# EAGLE design thermocouple-sensor (EAGLE 5.01)
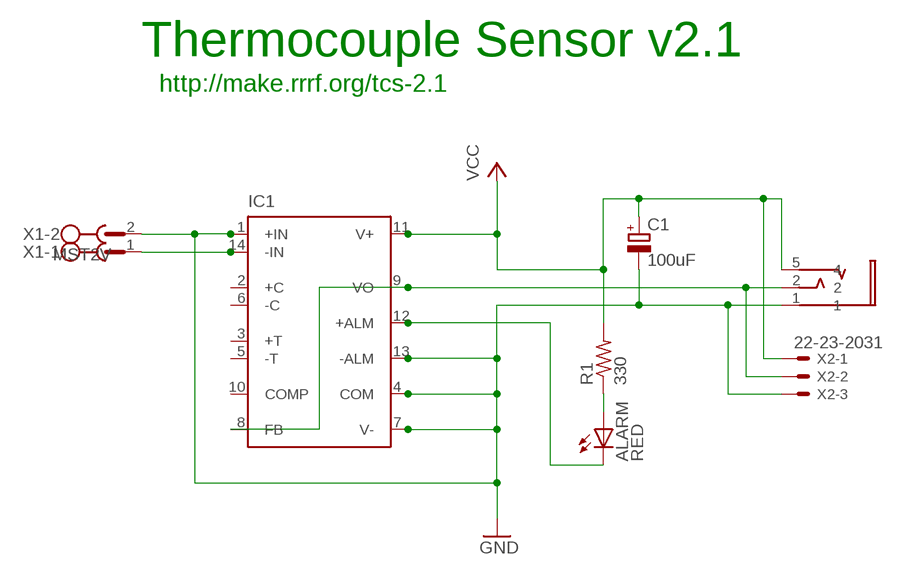
[diagram p0: schematic, sheet 1]

## Parts
ALARM  RED  LED5MM  [LED5MM]
C1  100uF  CPOL-EUE5-10.5  [E5-10,5]
IC1  AD595  [DIL14]
R1  330  R-US_0207/7  [0207/7]
U$1  3.5MM_JACKKYCON  [STX-3081]
X1  MST2V  [MSTBV2]
X2  22-23-2031  [22-23-2031]

## Nets
GND: C1.- IC1.1(+IN) IC1.4(COM) IC1.7(V-) IC1.13(-ALM) U$1.1 X1.2 X2.3
N$1: ALARM.A R1.1
N$2: ALARM.K(C) IC1.12(+ALM)
N$3: IC1.14(-IN) X1.1
N$5: IC1.8(FB) IC1.9(VO) U$1.2 X2.2
VCC: C1.+ IC1.11(V+) R1.2 U$1.5 X2.1
Unconnected: IC1.2(+C) IC1.3(+T) IC1.5(-T) IC1.6(-C) IC1.10(COMP)

## Notes on the sheet
- Thermocouple Sensor v2.1
- http://make.rrrf.org/tcs-2.1

## Library data of the parts
ALARM = led:LED: LED OSRAM: - CHIPLED LG R971, LG N971, LY N971, LG Q971, LY Q971, LO R971, LY R971 LH N974, LH R974 LS Q976, LO Q976, LY Q976 LO Q996 - Hyper CHIPLED LW Q18S LB Q993, LB Q99A, LB R99A - SideLED LS A670, LO A670, LY A670, LG A670, LP A670 LB A673, LV A673, LT A673, LW A673 LH A674 LY A675 LS A676, LA A676, LO A676, LY A676, LW A676 LS A679, LY A679, LG A679 - Hyper Micro SIDELED® LS Y876, LA Y876, LO Y876, LY Y876 LT Y87S - SmartLED LW L88C, LW L88S LB L89C, LB L89S, LG L890 LS L89K, LO L89K, LY L89K LS L896, LA L896, LO L896, LY L896 - TOPLED LS T670, LO T670, LY T670, LG T670, LP T670 LSG T670, LSP T670, LSY T670, LOP T670, LYG T670 LG T671, LOG T671, LSG T671 LB T673, LV T673, LT T673, LW T673 LH T674 LS T676, LA T676, LO T676, LY T676, LB T676, LH T676, LSB T676, LW T676 LB T67C, LV T67C, LT T67C, LS T67K, LO T67K, LY T67K, LW E67C LS E67B, LA E67B, LO E67B, LY E67B, LB E67C, LV E67C, LT E67C LW T67C LS T679, LY T679, LG T679 LS T770, LO T770, LY T770, LG T770, LP T770 LB T773, LV T773, LT T773, LW T773 LH T774 LS E675, LA E675, LY E675, LS T675 LS T776, LA T776, LO T776, LY T776, LB T776 LHGB T686 LT T68C, LB T68C - Hyper Mini TOPLED® LB M676 - Mini TOPLED Santana® LG M470 LS M47K, LO M47K, LY M47K Source: http://www.osram.convergy.de - LUMILED® LXK2-PW12-R00, LXK2-PW12-S00, LXK2-PW14-U00, LXK2-PW14-V00 LXK2-PM12-R00, LXK2-PM12-S00, LXK2-PM14-U00 LXK2-PE12-Q00, LXK2-PE12-R00, LXK2-PE12-S00, LXK2-PE14-T00, LXK2-PE14-U00 LXK2-PB12-K00, LXK2-PB12-L00, LXK2-PB12-M00, LXK2-PB14-N00, LXK2-PB14-P00, LXK2-PB14-Q00 LXK2-PR12-L00, LXK2-PR12-M00, LXK2-PR14-Q00, LXK2-PR14-R00 LXK2-PD12-Q00, LXK2-PD12-R00, LXK2-PD12-S00 LXK2-PH12-R00, LXK2-PH12-S00 LXK2-PL12-P00, LXK2-PL12-Q00, LXK2-PL12-R00 Source: www.luxeon.com
C1 = rcl:CPOL-EU: POLARIZED CAPACITOR, European symbol
IC1 = analog-devices:AD595: ANALOG DEVICES
R1 = rcl:R-US_: RESISTOR, American symbol
U$1 = reprap:3.5MM_JACK
X1 = con-phoenix-508:MST2V: PHOENIX
X2 = con-molex:22-23-2031: .100" (2.54mm) Center Header - 3 Pin

## Board
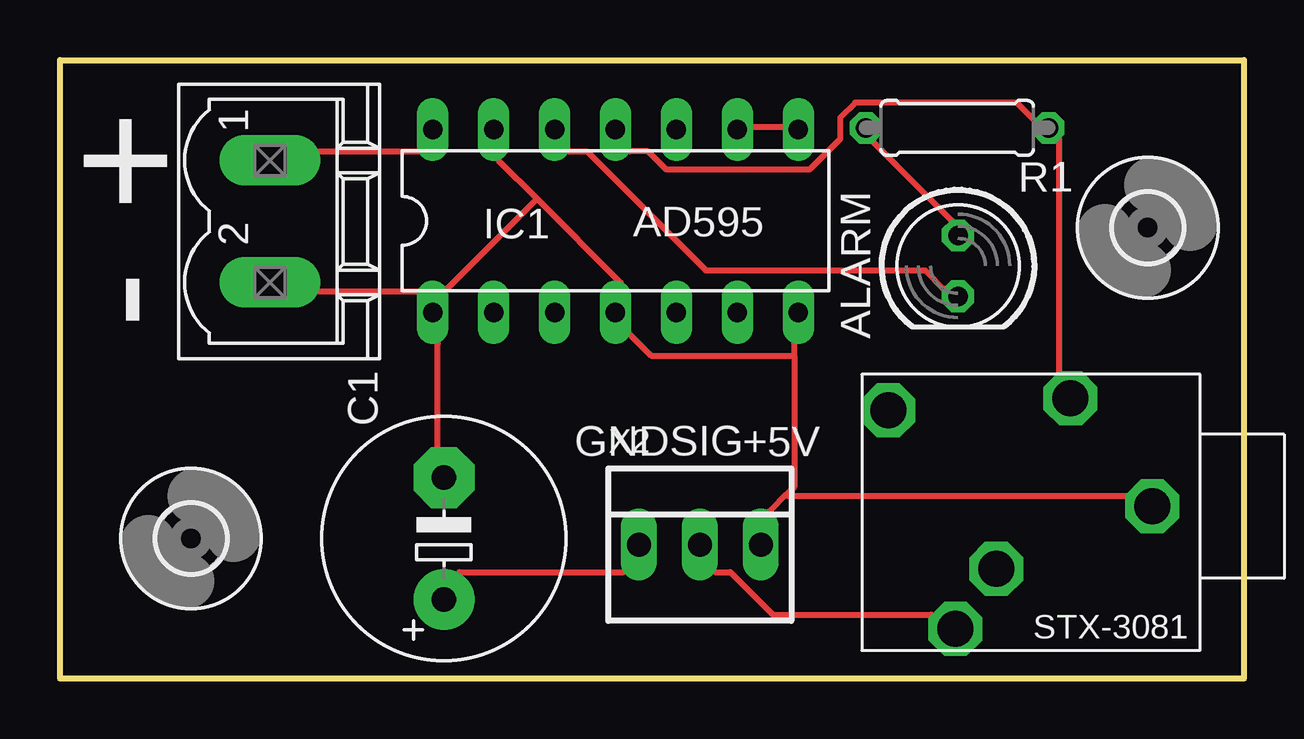
[diagram p1: board, top side]
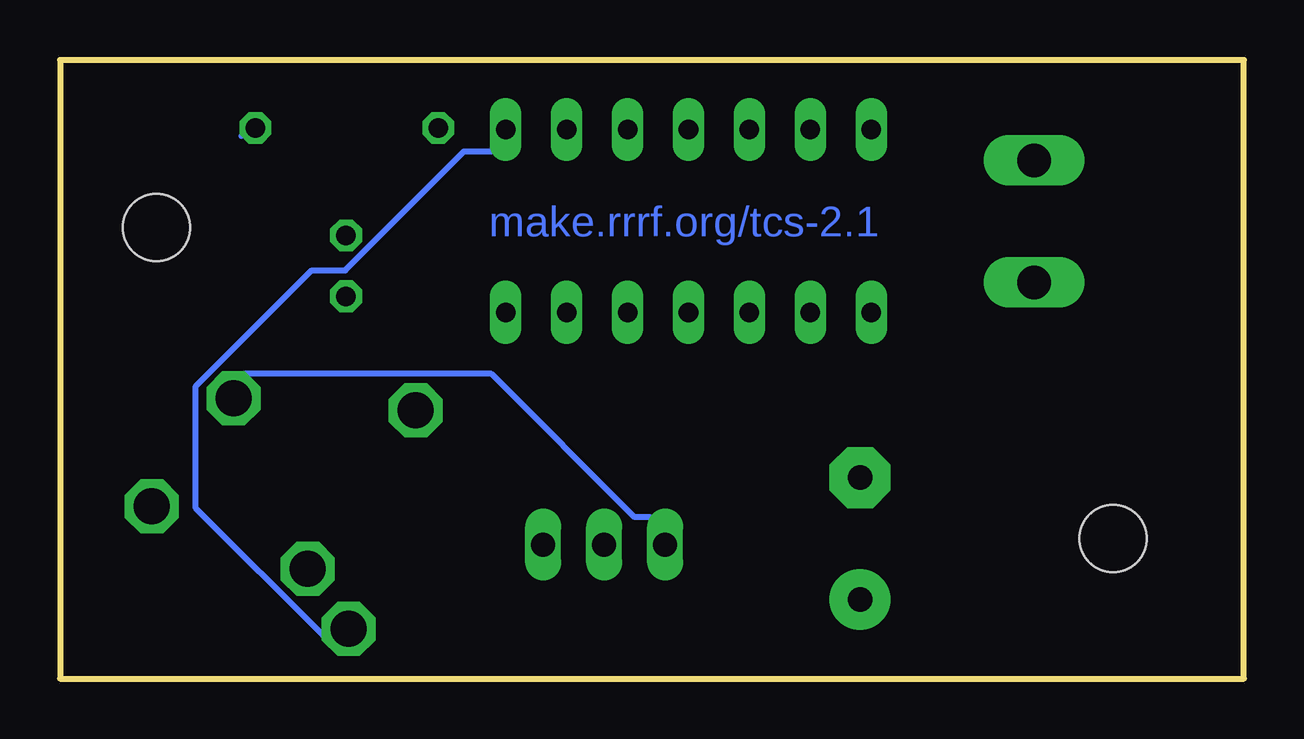
[diagram p2: board, bottom side, seen from below]

Size 49.35 x 25.78 mm. Coordinates in mm from the lower left corner, seen from the top.
Outline: 0,25.78 49.35,25.78 49.35,0 0,0 0,25.78
Copper layers (1*16): Top 0.035mm / dielectric 1.5mm / Bottom 0.035mm
Design rules "default": minimum track width 10mil, minimum drill 24mil, track to track 8mil, track to pad 8mil, pad to pad 8mil, via to via 8mil, smd to smd 8mil, copper to edge 40mil, drill to drill 8mil, minimum pad ring 10mil, minimum via ring 8mil, stop-mask expansion 4mil, vias tented up to drill 0mil, thermal gap 10mil

### Footprints (pad centres in the part's own frame; a part is rotated, then mirrored left to right if it is on the bottom)
LED5MM = drill 0.813 octagon: A -1.27,0; K 1.27,0
E5-10,5 = drill 1.016 pad 2.54 round: + -2.54,0 | drill 1.016 pad 2.54 octagon: - 2.54,0
DIL14 = drill 0.813 long: 1 -7.62,-3.81; 2 -5.08,-3.81; 3 -2.54,-3.81; 4 0,-3.81; 5 2.54,-3.81; 6 5.08,-3.81; 7 7.62,-3.81; 8 7.62,3.81; 9 5.08,3.81; 10 2.54,3.81; 11 0,3.81; 12 -2.54,3.81; 13 -5.08,3.81; 14 -7.62,3.81
0207/7 = drill 0.813 octagon: 1 -3.81,0; 2 3.81,0
STX-3081 = drill 1.5 pad 2.184 octagon: 1 2,5.5; 2 10.2,10.6; 3 8.5,8.1; 4 13,1.5; 5 5.4,1
2,8 = hole 2.8: 0,0
MSTBV2 = drill 1.397 long: 1 -2.54,0; 2 2.54,0
22-23-2031 = drill 1 long: 1 -2.54,0; 2 0,0; 3 2.54,0

### Placement (x,y rotation side)
ALARM  37.43,17.2 270 top
C1  16,5.84 90 top
IC1  23.16,19.08 0 top
R1  37.4,22.95 0 top
U$1  47.52,12.68 180 top
U$2  [2,8]  5.46,5.84 0 top
U$3  [2,8]  45.34,18.8 0 top
X1  8.75,19.06 270 top
X2  26.67,5.59 0 top

### Tracks (layer width: path | path; a pad name or v marks a point on that pad's centre or on a via)
GND
  Top 0.254: 30.61,13.46 30.61,8 30.29,7.68 | 30.61,13.46 30.61,13.97 IC1.7 | 30.29,7.68 29.59,6.98 X2.3 | U$1.1 44.45,7.62 30.35,7.62 30.29,7.68 | 19.88,20 23.37,16.51 IC1.4 23.75,14.35 24.64,13.46 30.61,13.46 | 19.88,20 18.29,21.59 IC1.13 | IC1.1 14.99,16.13 10.79,16.13 X1.2 | C1.- 15.75,9.52 15.75,13.97 IC1.1 | 19.88,20 16.13,16.26 IC1.1
N$1
  Top 0.254: R1.1 33.91,22.35 37.21,19.05 ALARM.A
N$2
  Top 0.254: IC1.12 21.21,21.97 21.97,21.97 26.92,17.02 36.07,17.02 36.83,16.26 ALARM.K
N$3
  Top 0.254: IC1.14 14.99,21.97 10.79,21.97 X1.1
N$5
  Top 0.254: IC1.9 28.83,22.99 30.23,22.99 IC1.8 | X2.2 27.3,4.45 27.94,4.45 29.72,2.67 36.32,2.67 U$1.2
  Bottom 0.254: IC1.8 31.37,21.97 32.51,21.97 37.46,17.02 38.86,17.02 43.69,12.19 43.69,7.11 38.35,1.78 U$1.2
VCC
  Top 0.254: X2.1 23.49,4.45 16.64,4.45 C1.+ | IC1.11 23.75,21.97 24.51,21.97 25.27,21.21 31.24,21.21 32.51,22.48 32.51,23.37 33.15,24 39.88,24 40.64,23.24 R1.2 41.66,22.48 41.66,12.7 U$1.5
  Bottom 0.254: R1.2 41.78,22.61 | X2.1 24.77,6.73 25.4,6.73 31.37,12.7 41.66,12.7 U$1.5

### Text on the board
Bottom: make.rrrf.org/tcs-2.1
tPlace: + | AD595 | - | GND | SIG | +5V